# EAGLE schematic op-amp (EAGLE 7.7.0)
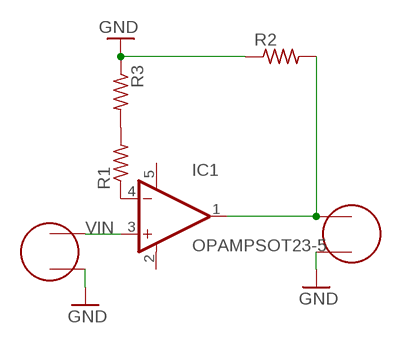
[diagram p0: schematic, sheet 1]

## Parts
IC1  OPAMPSOT23-5  [SOT23-5]
R1  RES-US1206FAB  [R1206FAB]
R2  RES-US1206FAB  [R1206FAB]
R3  RES-US1206FAB  [R1206FAB]
U$3  PINHD-2X1-SMD  [2X01SMD]
U$4  PINHD-2X1-SMD  [2X01SMD]

## Nets
GND: R2.1 R3.1 U$3.4 U$4.3
N$1: IC1.4(-IN) R1.1
N$2: R1.2 R3.2
VIN: IC1.3(+IN) U$4.4
VOUT: IC1.1(OUT) R2.2 U$3.3

## Power pins joined to a net without a drawn wire
V+: IC1.5(V+)
V-: IC1.2(V-)

## Library data of the parts
IC1 = fab-library:OPAMP: Rail-to-Rail Operational Amplifiers Single-Supply, MicroAmplifier(TM) Series
R1-R3 = fab-library:RES-US: Resistor (US Symbol) Variants with postfix FAB are widened to allow the routing of internal traces
U$3 U$4 = fab-library:PINHD-2X1-SMD